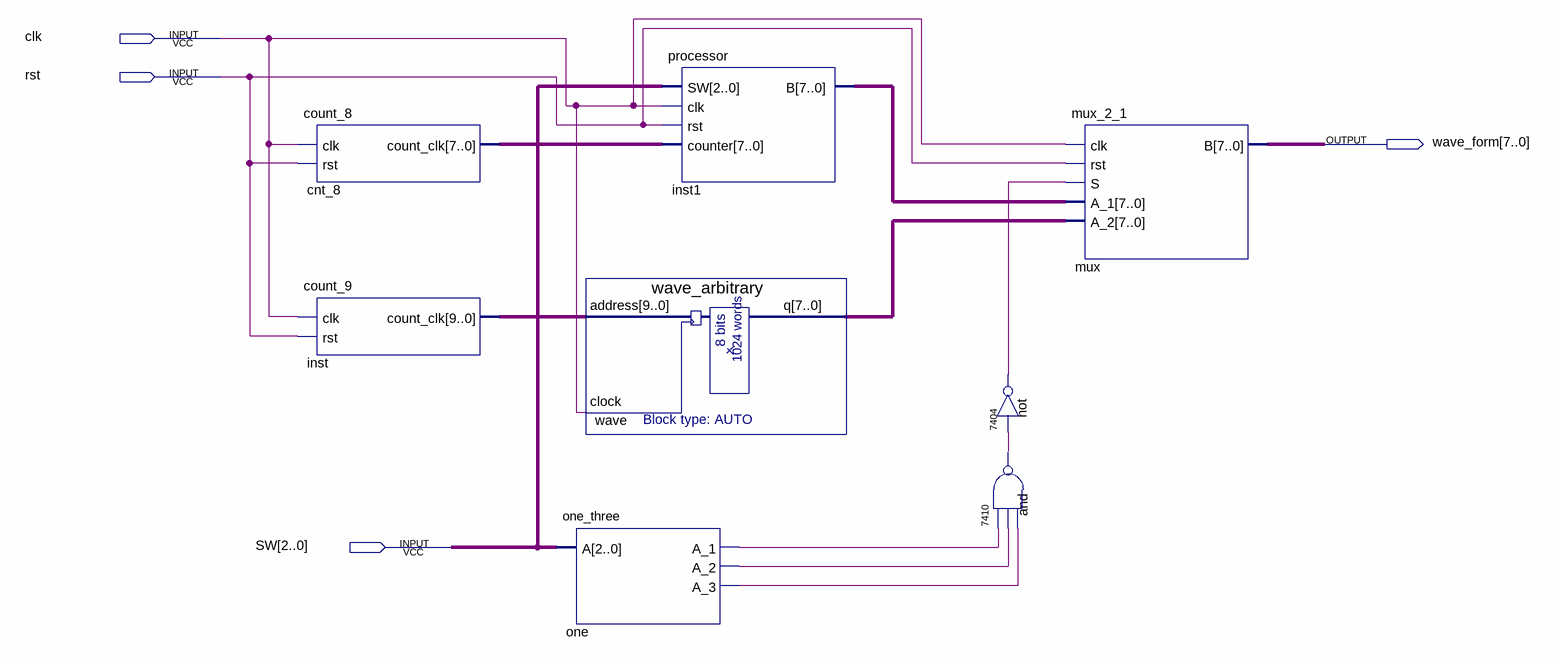
[diagram p0: schematic sheet]
// Quartus schematic wave_generator.bdf as structural Verilog: 8 symbols, 4 pins
module wave_generator (
  input  clk,
  input  rst,
  input  [2:0] SW,
  output [7:0] wave_form
);

  wire and_1, not_1, one_a_1, one_a_2, one_a_3;
  wire [7:0] cnt_8_count_clk, inst1_b, wave_q;
  wire [9:0] inst_count_clk;

  count_8 cnt_8 (.clk(clk), .rst(rst), .count_clk(cnt_8_count_clk));
  count_9 inst (.clk(clk), .rst(rst), .count_clk(inst_count_clk));
  wave_arbitrary wave (.address(inst_count_clk), .clock(clk), .q(wave_q));
  one_three one (.A(SW), .A_1(one_a_1), .A_2(one_a_2), .A_3(one_a_3));
  processor inst1 (.SW(SW), .clk(clk), .rst(rst), .counter(cnt_8_count_clk), .B(inst1_b));
  \7410  \and  (.\2 (one_a_1), .\3 (one_a_2), .\4 (one_a_3), .\1 (and_1));
  \7404  \not  (.\2 (and_1), .\1 (not_1));
  mux_2_1 mux (.clk(clk), .rst(rst), .S(not_1), .A_1(inst1_b), .A_2(wave_q), .B(wave_form));
endmodule
